# Altium project PCB_TransformersProject.PrjPcb
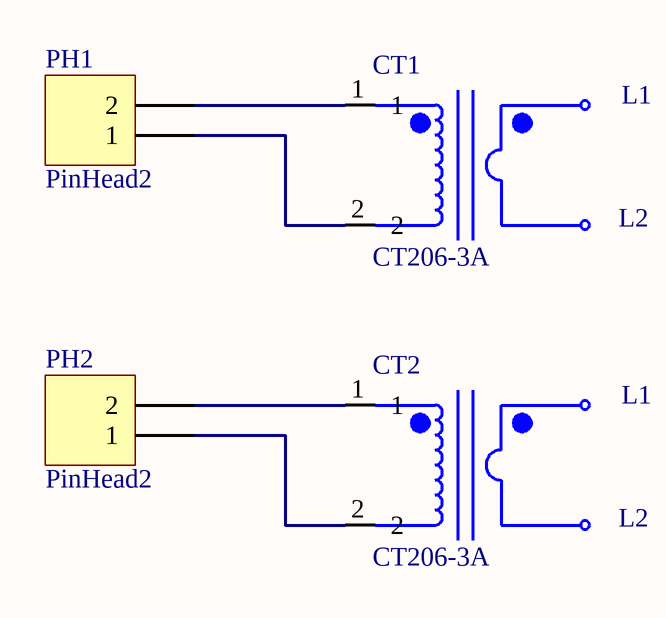
[diagram p0: Sheet1.SchDoc]
1 sheet, 4 parts. Net scope: global (net labels, ports and power ports of the same name join across sheets).
Board file: PCB1.PcbDoc

## Sheet Sheet1.SchDoc
size A4

### Parts
CT1  CT206-3A  [CT206-3A]
CT2  CT206-3A  [CT206-3A]
PH1  PinHead2  [PinHead2]
PH2  PinHead2  [PinHead2]

### Nets
NetCT1_1: CT1.1 PH1.2
NetCT1_2: CT1.2 PH1.1
NetCT2_1: CT2.1 PH2.2
NetCT2_2: CT2.2 PH2.1

### Notes on the sheet
- (in symbol CT206-3A) L1; L2

### Library data of the parts
CT1 CT2 = CT206-3A: PTH Current Transformer